# EAGLE design BreaV5 (EAGLE 9.2.2)

## Sheet 1 of 2
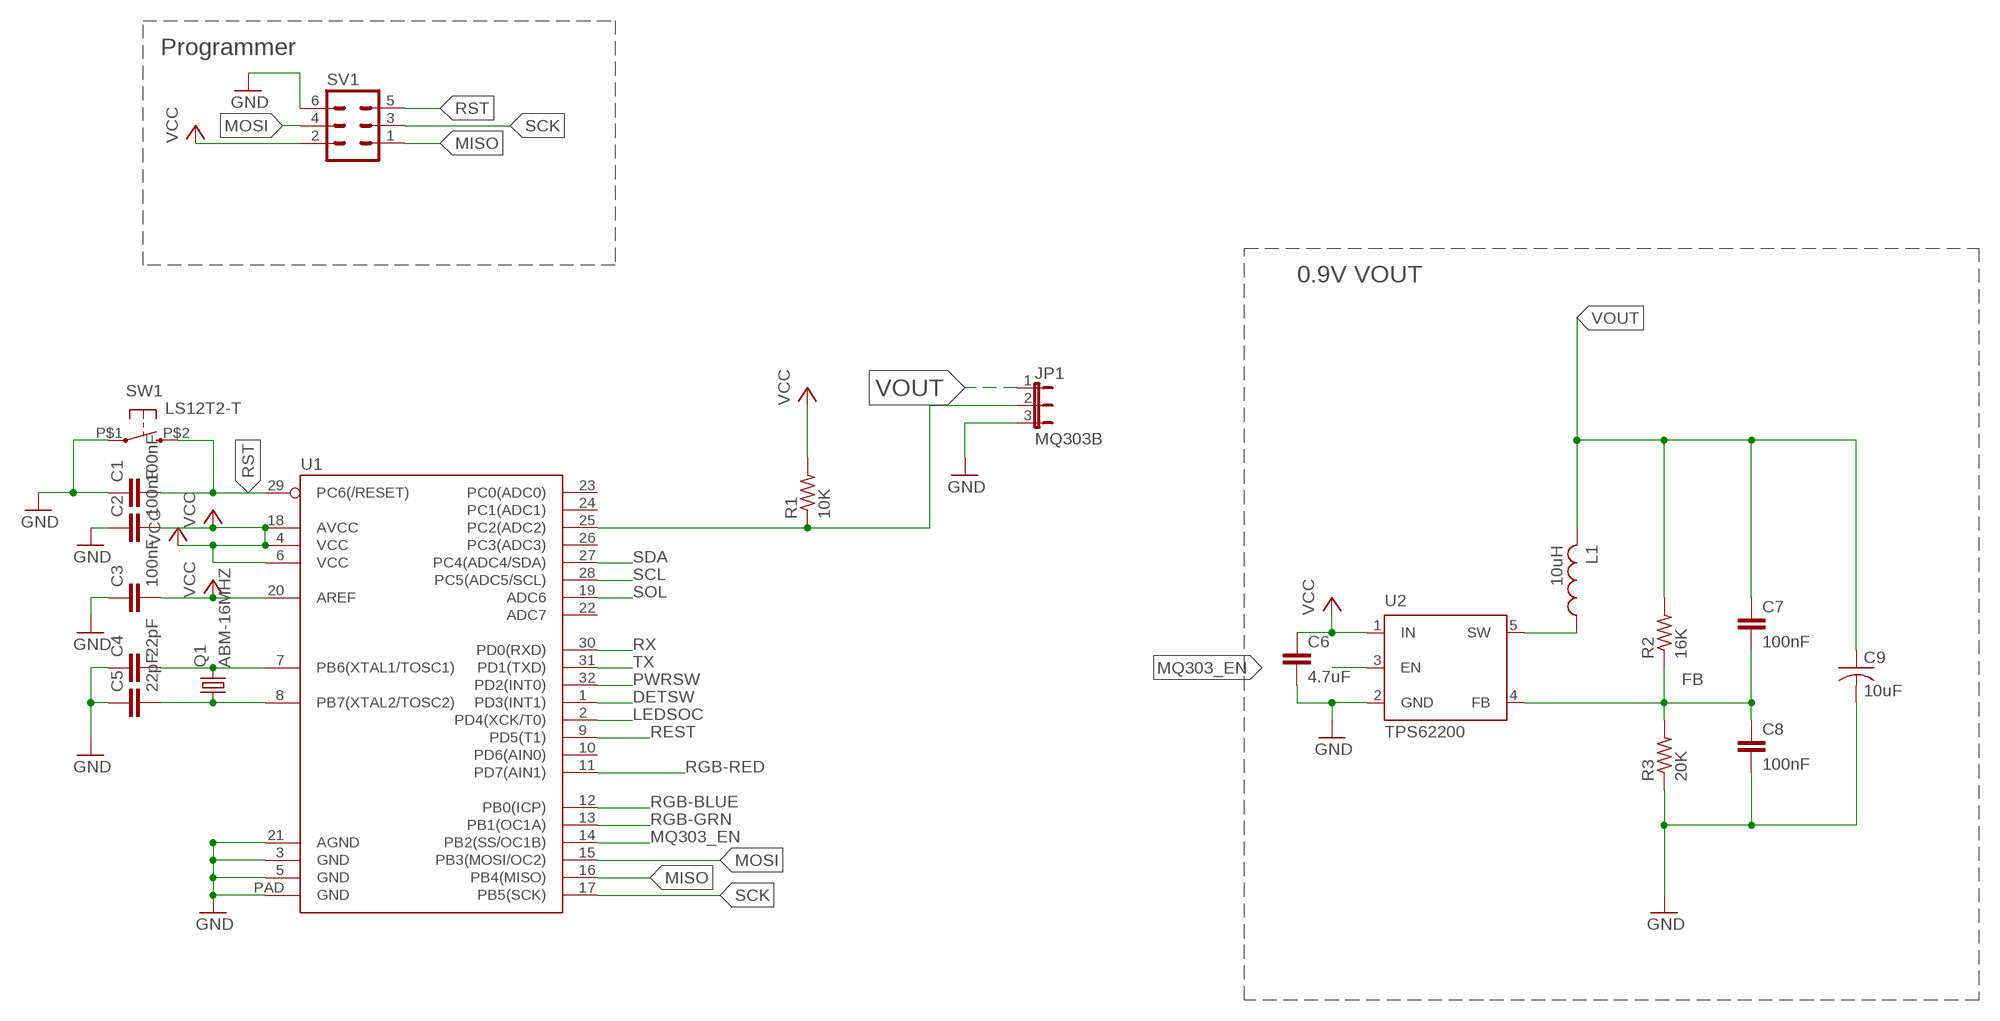
[diagram p0: schematic, sheet 1]

### Parts
C1  100nF  C-EUC0603  [C0603]
C2  100nF  C-EUC0603  [C0603]
C3  100nF  C-EUC0603  [C0603]
C4  22pF  C-EUC0603  [C0603]
C5  22pF  C-EUC0603  [C0603]
C6  4.7uF  C-EUC0402  [C0402]
C7  100nF  C-EUC0402  [C0402]
C8  100nF  C-EUC0402  [C0402]
C9  10uF  C-USC0805K  [C0805K]
JP1  MQ303B  JP2E  [JP2]
L1  10uH  L-USL2825P  [L2825P]
Q1  ABM-16MHZ  [ABM-16MHZ]
R1  10K  R-US_R0402  [R0402]
R2  16K  R-US_R0402  [R0402]
R3  20K  R-US_R0402  [R0402]
SV1  MA03-2  [MA03-2]
SW1  LS12T2-T  [LS12T2-T]
U1  ATMEGA328P_MLFMLF32  [MLF32-PAD]
U2  TPS62200  [TPS62200]

### Nets
DETSW: U1.1(PD3(INT1)) ; also sheet 2
FB: C7.2 C8.1 R2.1 R3.2 U2.4(FB)
GND: C1.1 C2.1 C3.1 C4.1 C5.1 C6.2 C8.2 C9.2 JP1.3 R3.1 SV1.6(MISO) SW1.P$1(S1) U1.3(GND) U1.5(GND) U1.21(AGND) U1.PAD(GND) U2.2(GND) ; also sheet 2
LEDSOC: U1.2(PD4(XCK/T0)) ; also sheet 2
MISO: SV1.1 U1.16(PB4(MISO))
MOSI: SV1.4 U1.15(PB3(MOSI/OC2))
MQ303_EN: U1.14(PB2(SS/OC1B)) U2.3(EN)
N$1: C5.2 Q1.P$1 U1.8(PB7(XTAL2/TOSC2))
N$2: C4.2 Q1.P$2 U1.7(PB6(XTAL1/TOSC1))
N$3: JP1.2 R1.1 U1.25(PC2(ADC2))
PWRSW: U1.32(PD2(INT0)) ; also sheet 2
REST: U1.9(PD5(T1)) ; also sheet 2
RGB-BLUE: U1.12(PB0(ICP)) ; also sheet 2
RGB-GRN: U1.13(PB1(OC1A)) ; also sheet 2
RGB-RED: U1.11(PD7(AIN1)) ; also sheet 2
RST: C1.2 SV1.5(VTG) SW1.P$2(S2) U1.29(PC6(/RESET))
RX: U1.30(PD0(RXD)) ; also sheet 2
SCK: SV1.3 U1.17(PB5(SCK))
SCL: U1.28(PC5(ADC5/SCL)) ; also sheet 2
SDA: U1.27(PC4(ADC4/SDA)) ; also sheet 2
SOL: U1.19(ADC6) ; also sheet 2
SW: L1.1 U2.5(SW)
TX: U1.31(PD1(TXD)) ; also sheet 2
VCC: C2.2 C3.2 C6.1 R1.2 SV1.2 U1.4(VCC) U1.6(VCC) U1.18(AVCC) U1.20(AREF) U2.1(IN) ; also sheet 2
VOUT: C7.1 C9.1 JP1.1 L1.2 R2.2
Unconnected: U1.10(PD6(AIN0)) U1.22(ADC7) U1.23(PC0(ADC0)) U1.24(PC1(ADC1)) U1.26(PC3(ADC3))

### Notes on the sheet
- Programmer
- 0.9V VOUT

## Sheet 2 of 2
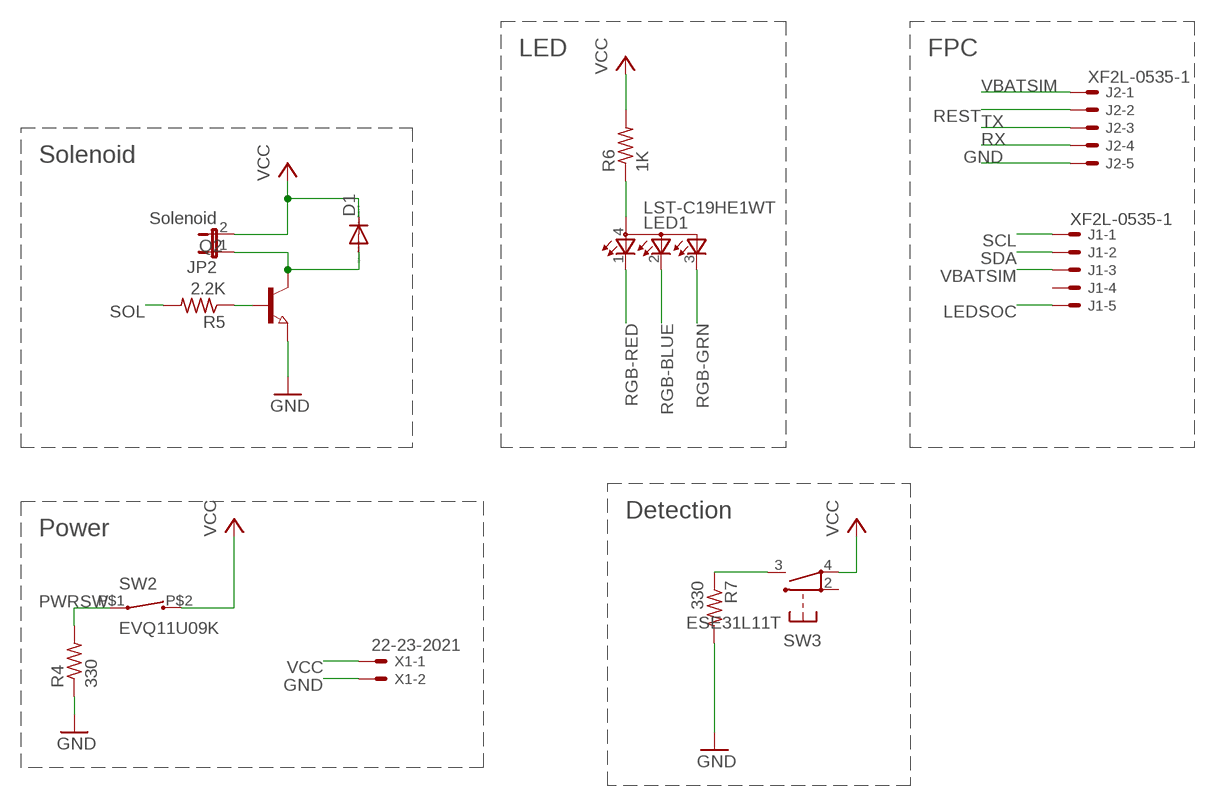
[diagram p1: schematic, sheet 2]

### Parts
D1  DIODE-SOD123  [SOD123]
J1  XF2L-0535-1  [XF2L-0535-1]
J2  XF2L-0535-1  [XF2L-0535-1]
JP2  Solenoid  JP1E  [JP1]
LED1  LST-C19HE1WT  [LST-C19HE1WT]
Q2  NPN-TRANSISTOR_SOT23  [SOT23]
R4  330  R-US_R0402  [R0402]
R5  2.2K  R-US_R0402  [R0402]
R6  1K  R-US_R0402  [R0402]
R7  330  R-US_R0402  [R0402]
SW2  EVQ11U09K  [EVQ11U-09K]
SW3  ESE31L11T  [SWITCH]
X1  22-23-2021  [22-23-2021]

### Nets
DETSW: R7.1 SW3.3 ; also sheet 1
GND: J2.5 Q2.2(E) R4.1 R7.2 X1.2 ; also sheet 1
LEDSOC: J1.5 ; also sheet 1
N$5: LED1.4(A) R6.1
N$9: D1.A JP2.1 Q2.3(C)
N$10: Q2.1(B) R5.1
PWRSW: R4.2 SW2.P$1 ; also sheet 1
REST: J2.2 ; also sheet 1
RGB-BLUE: LED1.2(CGREEN) ; also sheet 1
RGB-GRN: LED1.3(CBLUE) ; also sheet 1
RGB-RED: LED1.1(CRED) ; also sheet 1
RX: J2.4 ; also sheet 1
SCL: J1.1 ; also sheet 1
SDA: J1.2 ; also sheet 1
SOL: R5.2 ; also sheet 1
TX: J2.3 ; also sheet 1
VBATSIM: J1.3 J2.1
VCC: D1.C JP2.2 R6.2 SW2.P$2 SW3.4(C3) X1.1 ; also sheet 1
Unconnected: J1.4 SW3.2(C2)

### Notes on the sheet
- LED | FPC
- Solenoid
- Detection
- Power

## Library data of the parts
C1-C8 = rcl:C-EU: CAPACITOR, European symbol
C9 = resistor:C-US: CAPACITOR, American symbol
D1 = diode:DIODE-: DIODE
J1 J2 = adafruit:XF2*-05?: OMRON FPC Connector Source : http://www.omron.com/ecb/products/pdf/fpc.pdf
JP1 = jumper:JP2E: JUMPER
JP2 = jumper:JP1E: JUMPER
L1 = resistor:L-US: INDUCTOR, American symbol
LED1 = led:LST-C19HE1WT
Q1 = NewPart:ABM-16MHZ: Crystal 16MHz 18pF
Q2 = semicon-smd-ipc:NPN-TRANSISTOR_: NPN TRANSISTOR
R1-R7 = resistor:R-US_: RESISTOR, American symbol
SV1 = con-lstb:MA03-2: PIN HEADER; OC_FARNELL: unknown; OC_NEWARK: unknown
SW1 = NewPart:LS12T2-T: Side Switch for hardware reset
SW2 = NewPart:EVQ11U09K
SW3 = NewPart:ESE31L11T: Panasonic Detector Switch
U1 = SparkFun-DigitalIC:ATMEGA328P_MLF: 32-Pin Atmega328 part Commonly used on Arduino compatible boards Available in QFP and QFN packages TQFP is IC-09069 QFN is non-stock
U2 = NewPart:TPS62200: TI TPS62200 Buck Converter
X1 = con-molex:22-23-2021: .100" (2.54mm) Center Header - 2 Pin; MF: MOLEX; MPN: 22-23-2021; OC_FARNELL: 1462926; OC_NEWARK: 25C3832

## Board
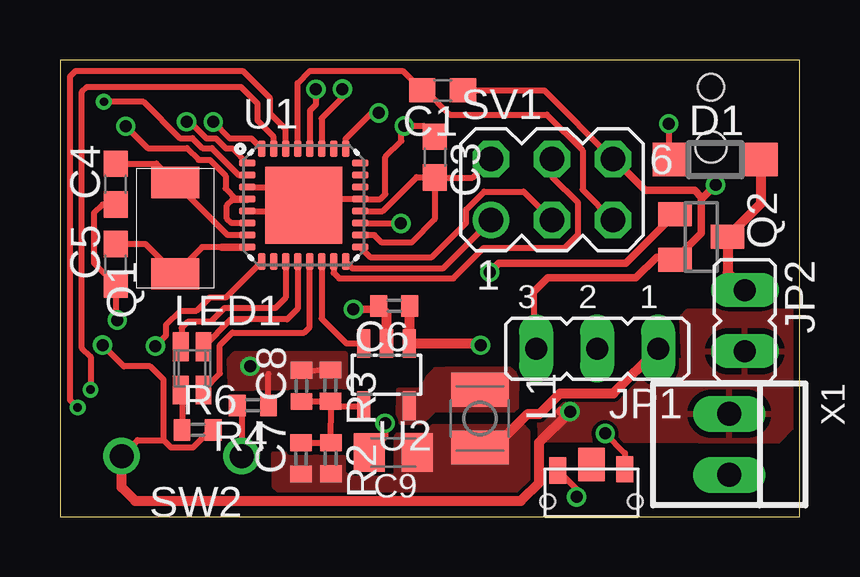
[diagram p2: board, top side]
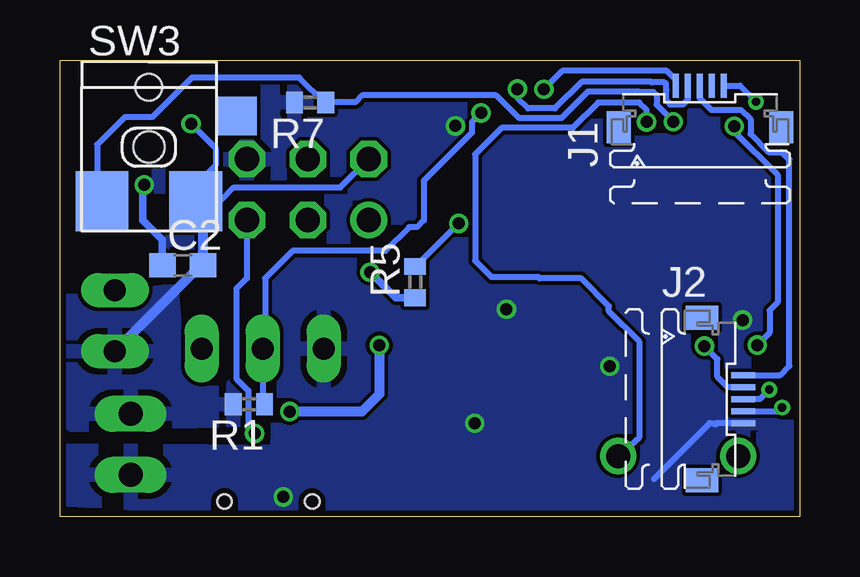
[diagram p3: board, bottom side, seen from below]

Size 30.83 x 19.04 mm. Coordinates in mm from the lower left corner, seen from the top.
Outline: 30.83,0 0,0 0,19.03 30.83,19.03
Outline: 30.83,0 30.83,0
Outline: 30.83,0 30.83,19.03
Outline: 30.83,19.03 30.83,19.04
Copper layers (1*16): Top 0.035mm / dielectric 1.5mm / Bottom 0.035mm
Design rules "SeeedStudio_2layer_DRU_no_angle_20140221": minimum track width 6mil, minimum drill 12mil, track to track 6mil, track to pad 6mil, pad to pad 6mil, via to via 6mil, smd to smd 0mil, copper to edge 10mil, drill to drill 10mil, minimum pad ring 10mil, minimum via ring 6mil, stop-mask expansion 2mil, vias tented up to drill 100mil, thermal gap 10mil

### Footprints (pad centres in the part's own frame; a part is rotated, then mirrored left to right if it is on the bottom)
C0603 = smd 1.1 x 1: 1 -0.85,0; 2 0.85,0
C0402 = smd 0.7 x 0.9: 1 -0.65,0; 2 0.65,0
C0805K = smd 1.3 x 1.6: 1 -1,0; 2 1,0
SOD123 = smd 1.4 x 1.4: A 1.9,0; C -1.9,0
XF2L-0535-1 = smd 1 x 0.25: 1 1.905,1; 2 1.905,0.5; 3 1.905,0; 4 1.905,-0.5; 5 1.905,-1 | smd 1.34 x 1: M1 0.18,3.388; M2 0.18,-3.388
JP2 = drill 0.914 long: 1 -2.54,0; 2 0,0; 3 2.54,0
JP1 = drill 0.914 long: 1 0,-1.27; 2 0,1.27
L2825P = smd 1.4 x 2.4: 1 -1.2,0; 2 1.2,0
LST-C19HE1WT = smd 0.65 x 1.2: 1 -0.475,0.9; 2 0.475,0.9; 3 0.475,-0.9; 4 -0.475,-0.9
ABM-16MHZ = smd 1.3 x 2: P$1 0.6,-1.6; P$2 4.4,-1.6
SOT23 = smd 1 x 1.4: 1 -0.95,-1.1; 2 0.95,-1.1; 3 0,1.1
R0402 = smd 0.7 x 0.9: 1 -0.65,0; 2 0.65,0
MA03-2 = drill 1.016: 1 -2.54,-1.27 | drill 1.016 octagon: 2 -2.54,1.27; 3 0,-1.27; 4 0,1.27; 5 2.54,-1.27; 6 2.54,1.27
LS12T2-T = smd 1.1 x 0.7: P$1 0.05,-1.41; P$2 0,1.39 | smd 1.4 x 1.1: P$3 -0.2,0 | hole 0.6: 1.35,-1.825; 1.35,1.825
EVQ11U-09K = drill 1: P$1 -2.5,0; P$2 2.5,0
SWITCH = smd 1.7 x 1.6: 2 3.65,1.3 | smd 2.2 x 2.5: 3 -1.95,-2.25; 4 1.95,-2.25 | hole 1.1: 0,2.5 | hole 1.3: 0,0
MLF32-PAD = smd 0.7 x 0.3: 1 -2.35,1.75; 2 -2.35,1.25; 3 -2.35,0.75; 4 -2.35,0.25; 5 -2.35,-0.25; 6 -2.35,-0.75; 7 -2.35,-1.25; 8 -2.35,-1.75; 17 2.35,-1.75; 18 2.35,-1.25; 19 2.35,-0.75; 20 2.35,-0.25; 21 2.35,0.25; 22 2.35,0.75; 23 2.35,1.25; 24 2.35,1.75 | smd 0.3 x 0.7: 9 -1.75,-2.35; 10 -1.25,-2.35; 11 -0.75,-2.35; 12 -0.25,-2.35; 13 0.25,-2.35; 14 0.75,-2.35; 15 1.25,-2.35; 16 1.75,-2.35; 25 1.75,2.35; 26 1.25,2.35; 27 0.75,2.35; 28 0.25,2.35; 29 -0.25,2.35; 30 -0.75,2.35; 31 -1.25,2.35; 32 -1.75,2.35 | smd 3.2 x 3.2: PAD 0,0
TPS62200 = smd 0.55 x 1.2: 1 -0.95,-1.3; 2 0,-1.3; 3 0.95,-1.3; 4 0.95,1.3; 5 -0.95,1.3
22-23-2021 = drill 1 long: 1 -1.27,0; 2 1.27,0

### Placement (x,y rotation side)
C1  15.94,17.77 180 top
C2  25.71,10.48 0 bottom
C3  15.61,14.99 270 top
C4  2.31,13.87 90 top
C5  2.31,10.53 90 top
C6  13.93,8.8 180 top
C7  10.04,2.44 90 top
C8  10.06,5.46 90 top
C9  13.88,2.69 180 top
D1  27.3,14.89 0 top
J1  4.16,16.06 90 bottom
J2  4.26,4.91 0 bottom
JP1  22.38,7.01 180 top
JP2  28.54,8.18 180 top
L1  17.5,4.1 270 top
LED1  5.51,6.19 0 top
Q1  3.21,9.53 90 top
Q2  26.72,11.67 270 top
R1  22.95,4.7 180 bottom
R2  11.28,2.45 270 top
R3  11.27,5.47 270 top
R4  8.04,4.65 180 top
R5  16.03,9.79 90 bottom
R6  5.74,3.63 0 top
R7  20.41,17.27 180 bottom
SV1  20.5,13.64 0 top
SW1  22.15,1.99 270 top
SW2  5.07,2.54 180 top
SW3  27.12,15.41 0 bottom
U1  10.16,12.99 0 top
U2  13.61,5.93 180 top
X1  27.88,3.03 270 top

### Tracks (layer width: path | path; a pad name or v marks a point on that pad's centre or on a via)
DETSW  (via drill 0.5)
  Top 0.254: v5.28,16.47 5.41,16.47 6.1,15.78 6.49,15.78 6.91,15.36 7.19,15.36 U1.1
  Bottom 0.254: SW3.3 29.28,13.36 29.28,15.51 28.13,16.66 26.99,16.66 25.34,18.31 20.86,18.31 19.82,17.27 R7.1 19.74,17.29 18.51,17.29 18.23,17.57 12.65,17.57 11.7,16.61 10.04,16.61 10.03,16.62 9.94,16.62 8.84,17.72 6.72,17.72 6.7,17.7 6.11,17.7 5.97,17.56 5.97,17.18 5.28,16.49 v5.28,16.47
FB
  Top 0.254: R3.2 11.04,4.61 12.64,4.61 U2.4 | C7.2 R2.1 11.29,4.74 R3.2 | C8.1 arc-90 10.08,4.83 R3.2
GND  (via drill 0.5)
  Top 0.254: U1.3 9.41,13.74 U1.PAD | U1.5 9.91,12.74 U1.PAD | U1.PAD 10.41,13.24 U1.21 13.35,13.24 13.56,13.45 13.56,15 14.22,15.66 14.22,16.17 v14.35,16.3 15.16,16.3 C3.1 | C1.1 20.18,17.77 SV1.6 | C9.2 12.78,2.83 | C9.2 12.64,3.09 | C4.1 1.76,13.02 1.42,12.67 1.42,10.58 C5.1 2.31,8.28 v2.39,8.2 | SW1.P$1 21.53,1.15 v21.53,0.83 | R3.1 10.07,6.04 C8.2 10.02,6.09 | v13.55,3.9 13.55,3.35 C9.2 | v7.91,6.27 v7.92,6.28 | 19.74,9.39 19.74,7.11 JP1.3 | R4.1 8.69,5.95
  Top 0.305: SV1.6 23.09,14.91 24.39,13.61 26.45,13.61 26.73,13.33 26.73,13.24 | v12.23,8.65 13.14,8.65 C6.2 | 26.73,13.24 26.73,11.83 Q2.2 25.5,10.83 24.86,10.83 24,9.97 20.32,9.97 19.74,9.39 | 26.73,13.24 v27.32,13.83
  Top 0.406: C6.2 13.45,8.8 | 13.4,8.68 C6.2 | U2.2 13.61,8.47 C6.2
  Bottom 0.254: 3.46,3.91 3.51,3.86 | J2.5 3.46,3.91 | 6.09,1.58 3.76,3.91 3.46,3.91
  Bottom 0.305: C2.1 26.56,11.54 27.38,12.36 27.38,13.77 v27.32,13.83
  pour Top (no thermals): 7.29,6.79 11.87,6.79 11.87,5.37 8.89,5.37 7.27,5.35 7.12,5.5 7.08,6.57
  pour Bottom: 0.25,18.96 29.97,18.96 30.09,18.84 30.09,15.66 29.71,15.28 26.67,15.28 26.83,14.75 26.19,11.43 23.45,10.25 23.11,7.28 21.69,6.64 21.77,2.72 30.5,2.78 30.44,0.71 21.2,0.17 0.5,0.17 0.25,0.42
LEDSOC  (via drill 0.35)
  Top 0.254: v1.83,17.3 3.48,17.3 4.99,15.79 5.52,15.79 5.94,15.37 6.33,15.37 7.45,14.24 U1.2
  Bottom 0.254: J1.5 2.5,17.97 v1.83,17.3
MISO
  Top 0.254: U1.16 12.2,10.35 15.94,10.35 SV1.1
MOSI
  Top 0.254: U1.15 11.41,10.17 11.63,9.95 16.39,9.95 17.66,11.21 21.02,11.21 21.59,11.77 21.59,13.1 20.52,14.16 20.52,14.89 SV1.4
MQ303_EN
  Top 0.254: U1.14 10.91,8.26 11.94,7.23 U2.3
N$1
  Top 0.254: 6.74,11.24 5.92,11.24 Q1.P$1 3.56,11.38 C5.2
  Top 0.305: U1.8 6.74,11.24
N$2
  Top 0.254: U1.7 7,11.74 Q1.P$2 4.02,14.72 C4.2
N$3  (via drill 0.5)
  Top 0.254: U1.25 11.91,15.75 12.99,16.84 v13.28,16.84
  Bottom 0.254: R1.1 22.38,4.77 JP1.2 22.28,7.11 22.28,9.95 21.14,11.09 17.27,11.09 16.28,12.08 15.95,12.08 15.67,12.36 15.67,14.01 13.67,16.01 13.67,16.45 v13.28,16.84
N$5
  Top 0.254: LED1.4 5.09,5.24 R6.1
N$9
  Top 0.406: JP2.1 27.82,10.17 Q2.3 29.2,13.05 D1.A
N$10  (via drill 0.5)
  Top 0.305: v17.9,10.2 18.28,10.58 23.58,10.58 Q2.1
  Bottom 0.305: v17.9,10.2 16.84,9.14 R5.1
PWRSW  (via drill 0.5)
  Top 0.254: v6.39,16.46 7.08,15.76 7.99,15.76 U1.32 | R4.2 arc-90 7.57,4.47 SW2.P$1
  Bottom 0.254: SW2.P$1 6.7,3.31 6.7,7.32 7.96,8.58 7.96,8.79 9.11,9.94 10.84,9.94 10.89,9.99 12.84,9.99 13.53,10.68 13.53,15.11 12.43,16.21 9.46,16.21 8.41,17.26 6.69,17.26 6.39,16.96 v6.39,16.46
REST  (via drill 0.5)
  Top 0.254: U1.9 6.9,9.14 6.24,9.14 5.7,8.6 5.03,8.6 4.43,8 4.43,7.57 v3.98,7.12
  Bottom 0.254: J2.2 3,5.41 3.44,5.85 3.44,6.58 v3.98,7.12
RGB-BLUE
  Top 0.254: U1.12 9.91,8.67 9.47,8.23 7.12,8.23 LED1.2
RGB-GRN
  Top 0.254: LED1.3 6.67,5.97 6.67,7.16 7.19,7.68 10.18,7.68 10.41,7.91 U1.13
RGB-RED
  Top 0.254: U1.11 9.41,9.14 8.97,8.7 6.85,8.7 6.28,8.13 5.32,8.13 5.07,7.88 5.07,7.12 LED1.1
RST  (via drill 0.5)
  Top 0.254: U1.29 9.91,18.08 10.41,18.58 14.28,18.58 C1.2 15.24,17.77 16.25,16.76 20.29,16.76 21.78,15.27 21.78,13.63 SV1.5 | v22.72,3.48 23.54,2.66 SW1.P$2
  Bottom 0.254: SV1.5 23.04,9.94 23.48,9.51 23.48,5.76 22.98,5.26 22.98,3.74 v22.72,3.48
RX  (via drill 0.35)
  Top 0.254: U1.30 9.39,15.36 9.39,16.17 8.76,16.8 8.76,17.44 7.61,18.59 0.66,18.59 0.43,18.36 0.43,4.87 v0.74,4.56
  Bottom 0.254: J2.4 0.89,4.41 v0.74,4.56
SCK
  Top 0.254: SV1.3 19.32,13.55 17.67,13.55 16.92,12.8 16.92,12.25 15.5,10.83 12.92,10.83 U1.17
SCL  (via drill 0.5)
  Top 0.254: v10.66,17.82 10.66,17.18 10.41,16.93 U1.28
  Bottom 0.254: v10.66,17.82 9.89,18.59 5.54,18.59 5.16,18.21 J1.1
SDA  (via drill 0.5)
  Top 0.254: U1.27 10.91,16.61 11.77,17.47 v11.77,17.83
  Bottom 0.254: v11.77,17.83 11.77,17.47 11.32,17.02 10.21,17.02 9.1,18.13 6.19,18.13 6.17,18.11 5.63,18.11 5.57,18.05 5.57,17.8 5.56,17.8 5.56,17.35 5.4,17.19 4.87,17.19 4.66,17.4 J1.2
SOL  (via drill 0.5)
  Top 0.254: U1.19 14.19,12.24 v14.21,12.23
  Bottom 0.254: v14.21,12.23 16,10.44 R5.2
SW
  pour Top (no thermals): 14.19,5.27 14.12,5.26 14.1,4.05 14.25,3.94 15.03,3.96 15.32,4.22 15.59,4.48 15.95,4.49 18.86,4.46 19.02,4.6 19.03,5.88 18.75,6.13 16.45,6.15 15.65,6.12 15.34,5.79 15.07,5.28
TX  (via drill 0.35)
  Top 0.254: U1.31 8.91,15.84 8.23,16.52 8.23,17.23 7.54,17.92 1.13,17.92 0.92,17.71 0.92,7.04 1.27,6.68 v1.27,5.3
  Bottom 0.254: v1.27,5.3 1.67,4.91 J2.3
VBATSIM
  Bottom 0.254: J1.3 4.19,17.56 4.19,17.46 3.69,16.96 2.45,16.96 2.05,16.56 2.05,15.96 1.3,15.21 0.76,15.21 0.44,14.88 0.44,6.3 0.83,5.91 J2.1
VCC  (via drill 0.5)
  Top 0.254: U1.18 13.1,11.74 13.41,11.43 14.65,11.43 15.61,12.4 C3.2 | U1.6 7.15,12.24 6.96,12.43 6.96,12.99 7.21,13.24 | C3.2 17.2,14.14 SV1.2 | v25.37,16.38 25.37,14.93 D1.C | R6.2 6.28,3.63 5.55,2.9 4.62,2.9 4.32,3.21 | v1.78,7.16 2.66,6.28 3.76,6.28 4.32,5.72 4.32,3.21 | SW2.P$2 3.23,3.21 4.32,3.21 | U1.4 7.35,13.24 6.91,13.69 6.91,14.22 6.24,14.88 5.78,14.88 5.29,15.37 3.65,15.37 v2.74,16.28 | U1.20 13.44,12.74 14.86,14.16 15.6,14.16 C3.2
  Top 0.305: U1.4 7.21,13.24
  Top 0.406: 20.87,4.39 v21.25,4.39 19.97,3.11 19.97,1.43 19.21,0.67 3.13,0.67 2.57,1.23 SW2.P$2 | C6.1 14.56,8.77 U2.1 17.44,7.23 v17.52,7.15
  Bottom 0.254: SV1.2 19.14,13.73 23.58,13.73 24.12,13.2 25.13,13.2 SW3.4 | v25.37,16.38 24.33,15.34 24.33,14.68 25.17,13.83 | v1.78,7.16 1.26,7.68 1.26,8.61 0.93,8.94 0.93,14.25 2.74,16.06 v2.74,16.28
  Bottom 0.406: 25.17,13.83 SW3.4 24.86,12.84 24.86,10.59 | C2.2 24.86,10.59 | 24.86,10.59 JP2.2 | 21.07,4.39 v21.25,4.39 18.25,4.39 17.52,5.11 v17.52,7.15
  pour Bottom: 22.98,6.13 25.93,6.49 26.17,9.42 29.14,9.06 30.47,9.21 30.44,5.75 30.52,5.74 30.41,3.96 30.29,3.83 23.22,4.06 23.01,4.43 22.98,3.75
  pour Top: 26.17,8.57 30.46,8.57 30.46,3.72 29.9,3.16 20.03,3.21 19.99,5.27 23.46,5.3 24.64,6.48 26.02,6.52 25.94,8.33
VOUT
  Top 0.406: 17.46,2.65 L1.2 18.08,2.88 19.5,4.3 19.99,4.3 20.84,5.15 23.06,5.15 JP1.1
  pour Top (no thermals): 8.93,2.62 11.63,2.61 11.78,2.48 11.77,1.87 11.91,1.7 13.86,1.69 14.03,1.75 14.03,3.36 14.09,3.41 15.3,3.43 15.55,3.76 15.82,3.76 19.29,3.75 19.48,3.54 19.5,1.2 19.12,0.92 9.4,0.89 8.95,1.29